# Altium project BoatCoreBoard.PrjPcb
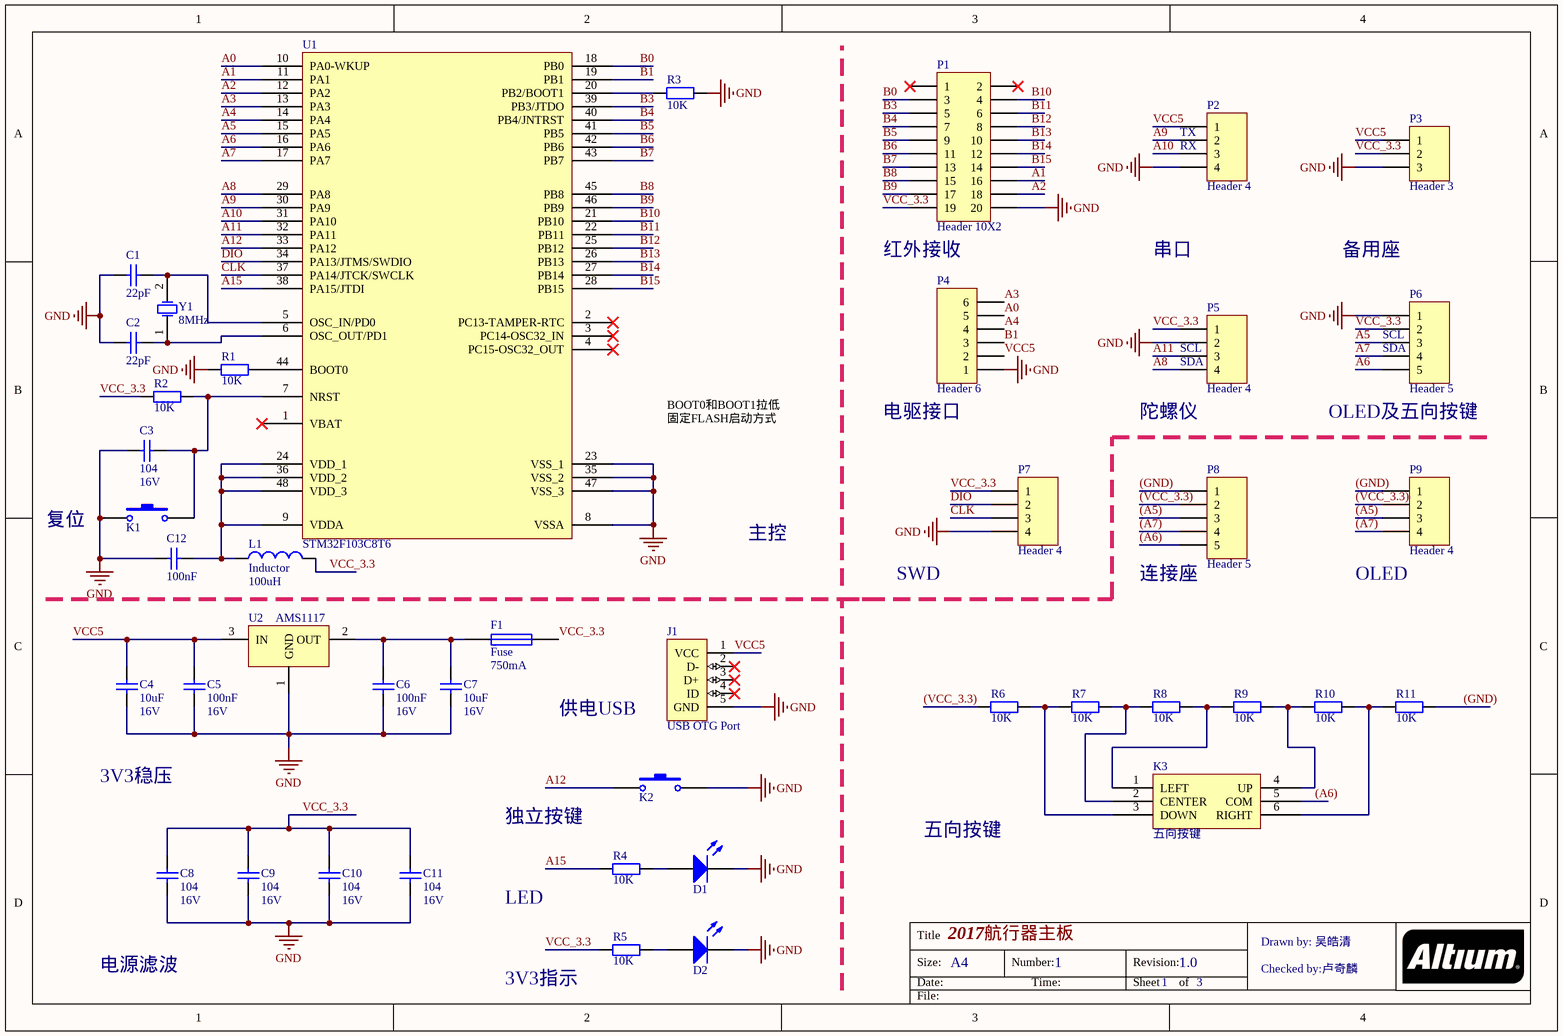
[diagram p0: core.SchDoc]
1 sheet, 43 parts. Net scope: global (net labels, ports and power ports of the same name join across sheets).
Board file: core.PcbDoc

## Sheet core.SchDoc: 2017航行器主板
size A4; Date: 2017/5/15; CheckedBy: 卢奇麟; Author: 吴皓清; DrawnBy: 吴皓清; DocumentNumber: 1; Revision: 1.0; SheetNumber: 1; SheetTotal: 3

### Parts
C1  value 22pF  [0805]  (hidden comment: Cap)
C2  value 22pF  [0805]  (hidden comment: Cap)
C3  value 104  Pressure Voltage: 16V  [0805]  (hidden comment: Cap)
C4  value 10uF  Pressure Voltage: 16V  [0805]  (hidden comment: Cap)
C5  value 100nF  Pressure Voltage: 16V  [0805]  (hidden comment: Cap)
C6  value 100nF  Pressure Voltage: 16V  [0805]  (hidden comment: Cap)
C7  value 10uF  Pressure Voltage: 16V  [0805]  (hidden comment: Cap)
C8  value 104  Pressure Voltage: 16V  [0805]  (hidden comment: Cap)
C9  value 104  Pressure Voltage: 16V  [0805]  (hidden comment: Cap)
C10  value 104  Pressure Voltage: 16V  [0805]  (hidden comment: Cap)
C11  value 104  Pressure Voltage: 16V  [0805]  (hidden comment: Cap)
C12  value 100nF  [0805]  (hidden comment: Cap)
D1  LED  [LED_0805]  (value not drawn)
D2  LED  [LED_0805]  (value not drawn)
F1  Fuse  I hold: 750mA  [0805]
J1  USB OTG Port  [Micro USB母座贴片]
K1  Key  [贴片按键3*6mm]  (value not drawn)
K2  Key  [贴片按键3*6mm]  (value not drawn)
K3  五向按键  [五向按键]
L1  Inductor  value 100uH  [0805]
P1  Header 10X2  [HDR2X10]
P2  Header 4  [HDR1X4]
P3  Header 3  [HDR1X3]
P4  Header 6  [HDR1X6]
P5  Header 4  [HDR1X4]
P6  Header 5  [HDR1X5]
P7  Header 4  [HDR1X4]
P8  Header 5  [HDR1X5]
P9  Header 4  [HDR1X4]
R1  value 10K  [0805]  (hidden comment: Res)
R2  value 10K  [0805]  (hidden comment: Res)
R3  value 10K  [0805]  (hidden comment: Res)
R4  value 10K  [0805]  (hidden comment: Res)
R5  value 10K  [0805]  (hidden comment: Res)
R6  value 10K  [0805]  (hidden comment: Res)
R7  value 10K  [0805]  (hidden comment: Res)
R8  value 10K  [0805]  (hidden comment: Res)
R9  value 10K  [0805]  (hidden comment: Res)
R10  value 10K  [0805]  (hidden comment: Res)
R11  value 10K  [0805]  (hidden comment: Res)
U1  STM32F103C8T6  [STM32F103C8T6]
U2  AMS1117  [AMS1117]
Y1  value 8MHz  [晶振49S型]  (hidden comment: 晶振)

### Nets
GND: C1.1 C2.1 C3.1 C4.1 C5.1 C6.1 C7.1 C8.1 C9.1 C10.1 C11.1 C12.1 D1.2(K) D2.2(K) J1.5(GND) K1.1 K2.2 P1.20 P2.4 P3.3 P4.1 P5.2 P6.1 P7.4 R1.1 R3.2 U1.8(VSSA) U1.23(VSS_1) U1.35(VSS_2) U1.47(VSS_3) U2.1(GND)
(A5): P8.3 P9.3
(A6): K3.5(COM) P8.5
(A7): P8.4 P9.4
(GND): P8.1 P9.1 R11.2
(VCC_3.3): P8.2 P9.2 R6.1
A0: P4.5 U1.10(PA0-WKUP)
A1: P1.16 U1.11(PA1)
A2: P1.18 U1.12(PA2)
A3: P4.6 U1.13(PA3)
A4: P4.4 U1.14(PA4)
A5: P6.3 U1.15(PA5)
A6: P6.5 U1.16(PA6)
A7: P6.4 U1.17(PA7)
A8: P5.4 U1.29(PA8)
A9: P2.2 U1.30(PA9)
A10: P2.3 U1.31(PA10)
A11: P5.3 U1.32(PA11)
A12: K2.1 U1.33(PA12)
A15: R4.1 U1.38(PA15/JTDI)
B0: P1.3 U1.18(PB0)
B1: P4.3 U1.19(PB1)
B3: P1.5 U1.39(PB3/JTDO)
B4: P1.7 U1.40(PB4/JNTRST)
B5: P1.9 U1.41(PB5)
B6: P1.11 U1.42(PB6)
B7: P1.13 U1.43(PB7)
B8: P1.15 U1.45(PB8)
B9: P1.17 U1.46(PB9)
B10: P1.4 U1.21(PB10)
B11: P1.6 U1.22(PB11)
B12: P1.8 U1.25(PB12)
B13: P1.10 U1.26(PB13)
B14: P1.12 U1.27(PB14)
B15: P1.14 U1.28(PB15)
CLK: P7.3 U1.37(PA14/JTCK/SWCLK)
DIO: P7.2 U1.34(PA13/JTMS/SWDIO)
VCC5: C4.2 C5.2 J1.1(VCC) P2.1 P3.1 P4.2 U2.3(IN)
VCC_3.3: C8.2 C9.2 C10.2 C11.2 F1.2 L1.2 P1.19 P3.2 P5.1 P6.2 P7.1 R2.1 R5.1
NetC1_2: C1.2 U1.5(OSC_IN/PD0) Y1.2(OSC2)
NetC2_2: C2.2 U1.6(OSC_OUT/PD1) Y1.1(OSC1)
NetC3_2: C3.2 K1.2 R2.2 U1.7(NRST)
NetC6_2: C6.2 C7.2 F1.1 U2.2(OUT)
NetC12_2: C12.2 L1.1 U1.9(VDDA) U1.24(VDD_1) U1.36(VDD_2) U1.48(VDD_3)
NetD1_1: D1.1(A) R4.2
NetD2_1: D2.1(A) R5.2
NetK3_1: K3.1(LEFT) R8.2 R9.1
NetK3_2: K3.2(CENTER) R7.2 R8.1
NetK3_3: K3.3(DOWN) R6.2 R7.1
NetK3_4: K3.4(UP) R9.2 R10.1
NetK3_6: K3.6(RIGHT) R10.2 R11.1
NetR1_2: R1.2 U1.44(BOOT0)
NetR3_1: R3.1 U1.20(PB2/BOOT1)

Not connected (* = marked no-connect by the designer): J1 2(D-)* 3(D+)* 4(ID)*; P1 1* 2*; U1 1(VBAT)* 2(PC13-TAMPER-RTC)* 3(PC14-OSC32_IN)* 4(PC15-OSC32_OUT)*

### Notes on the sheet
- (near P2) TX
- (near P2) RX
- (near P1) 红外接收
- 串口
- 备用座
- (near P5) SCL
- (near P5) SDA
- (near P6) SCL
- (near P6) SDA
- BOOT0和BOOT1拉低固定FLASH启动方式
- 电驱接口
- 陀螺仪
- (near P6) OLED及五向按键
- 复位
- 主控
- SWD
- (near P8) 连接座
- (near P9) OLED
- 供电USB
- 3V3稳压
- 独立按键
- 五向按键
- LED
- 电源滤波
- 3V3指示
- Drawn by: 吴皓清
- Checked by:卢奇麟
- Title
- Size:
- Date:
- A4
- Number:
- Time:
- Revision:
- Sheet
- of
- File:

### Library data of the parts
C1 C2 C12 = Cap: 原理图绘制者: 刘永钦; 原理图何处使用过: 2014年飞思卡尔底板; 原理图审核人1: 徐鹏飞; 封装0805何处使用: 2015年航行器遥控器; 原理图审核人2: 朱觉文; 封装0603何处使用过: 在2401转接板上使用; Pressure Voltage: 16V; 原理图提供者: 刘永钦; 封装0805绘制者: 刘永钦; 封装0805提供者: 刘永钦; 封装0805审核人1: 徐鹏飞; 封装0805审核人2: 朱觉文; 封装0603绘制者: 刘永钦; 封装0603提供者: 刘永钦; 封装0603审核人1: 朱觉文; 封装0603审核人2: 徐鹏飞
C3-C11 = Cap: 原理图绘制者: 刘永钦; 原理图何处使用过: 2014年飞思卡尔底板; 原理图审核人1: 徐鹏飞; 封装0805何处使用: 2015年航行器遥控器; 原理图审核人2: 朱觉文; 封装0603何处使用过: 在2401转接板上使用; 原理图提供者: 刘永钦; 封装0805绘制者: 刘永钦; 封装0805提供者: 刘永钦; 封装0805审核人1: 徐鹏飞; 封装0805审核人2: 朱觉文; 封装0603绘制者: 刘永钦; 封装0603提供者: 刘永钦; 封装0603审核人1: 朱觉文; 封装0603审核人2: 徐鹏飞
D1 D2 = LED: 原理图绘制者: 刘永钦; 原理图何处使用过: 2014年飞思卡尔底板; 原理图审核人1: 徐鹏飞; Color: 蓝色; 封装1210LED何处使用过: 2014年的一个小板子; 封装LED_3mm何处使用过: 2014年变频器面板; 封装LED_0805使用过: 2015年飞思卡尔底板; 原理图审核人2: 朱觉文; 封装LED0603何处使用过: 2401转接板; 原理图提供者: 刘永钦; 封装1210LED绘制者: 刘永钦; 封装1210LED提供者: 刘永钦; 封装1210LED审核人1: 徐鹏飞; 封装LED_3mm绘制者: 刘永钦; 封装LED_3mm提供者: 刘永钦; 封装LED_0805绘制者: 刘永钦; 封装LED_0805提供者: 刘永钦; 封装LED_0805审核人1: 徐鹏飞; 封装1210LED审核人2: 朱觉文; 封装LED_0805审核人2: 朱觉文; 封装LED_3mm审核者2: 朱觉文; 封装LED0603绘制者: 刘永钦; 封装LED0603审核人2: 朱觉文; 封装LED0603提供者: 刘永钦; 封装LED0603审核人1: 徐鹏飞
F1 = Fuse: 封装1812审核人2: 朱觉文; 封装1812审核人1: 徐鹏飞; 封装1812提供者: 刘永钦; 封装1812何处使用过: 2401转接板; 封装1812绘制者: 刘永钦; 原理图审核人2: 朱觉文; 原理图审核人1: 徐鹏飞; 原理图何处使用过: 2401转接板; 原理图提供者: 刘永钦; 原理图绘制者: 刘永钦
J1 = USB OTG Port: 原理图绘制者: 刘永钦; 原理图何处使用过: 2014年飞思卡尔底板; 原理图审核人1: 徐鹏飞; 封装Micro USB母座贴片使用过: 2014年一个小板子; 原理图审核人2: 朱觉文; 原理图提供者: 刘永钦; 封装Micro USB母座贴片绘制者: 刘永钦; 封装Micro USB母座贴片提供者: 刘永钦; 封装Micro USB母座贴片审核人1: 徐鹏飞; 封装Micro USB母座贴片审核人2: 朱觉文
K1 K2 = Key: 原理图绘制者: 刘永钦; 原理图何处使用过: 2014年飞思卡尔底板; 原理图审核人1: 徐鹏飞; 封装贴片按键3*6mm何处使用过: 2015年飞思卡尔底板; 封装四脚按键6*6mm使用过: 2014年变频器面板; 原理图审核人2: 朱觉文; 原理图提供者: 刘永钦; 封装贴片按键3*6mm绘制者: 刘永钦; 封装贴片按键3*6mm提供者: 刘永钦; 封装贴片按键3*6mm审核人1: 徐鹏飞; 封装四脚按键6*6mm绘制者: 刘永钦; 封装四脚按键6*6mm提供者: 刘永钦; 封装四脚按键6*6mm审核人1: 徐鹏飞; 封装四脚按键6*6mm审核人2: 朱觉文; 封装贴片按键3*6mm审核人2: 朱觉文
L1 = Inductor: 原理图绘制者: 刘永钦; 原理图何处使用过: 2014年飞思卡尔底板; 原理图审核人1: 徐鹏飞; 封装0805_Inductor绘制者: 未知; 封装0805_Inductor使用过: 2015年飞思卡尔底板; 原理图审核人2: 朱觉文; 原理图提供者: 刘永钦; 封装0805_Inductor提供者: 刘永钦; 封装0805_Inductor审核人1: 徐鹏飞; 封装0805_Inductor审核人2: 朱觉文
P1 = Header 10X2: Header, 10-Pin, Dual row; LatestRevisionDate: 17-Jul-2002; LatestRevisionNote: Re-released for DXP Platform.; Publisher: Altium Limited
P2 P5 P7 P9 = Header 4: Header, 4-Pin; LatestRevisionDate: 17-Jul-2002; LatestRevisionNote: Re-released for DXP Platform.; Publisher: Altium Limited
P3 = Header 3: Header, 3-Pin; LatestRevisionDate: 17-Jul-2002; LatestRevisionNote: Re-released for DXP Platform.; Publisher: Altium Limited
P4 = Header 6: Header, 6-Pin; LatestRevisionDate: 17-Jul-2002; LatestRevisionNote: Re-released for DXP Platform.; Publisher: Altium Limited
P6 P8 = Header 5: Header, 5-Pin; LatestRevisionDate: 17-Jul-2002; LatestRevisionNote: Re-released for DXP Platform.; Publisher: Altium Limited
R1-R11 = Res: 原理图绘制者: 刘永钦; 原理图何处使用过: 2014年飞思卡尔底板; 原理图审核人1: 徐鹏飞; 封装0805何处使用过: 2015年航行器遥控器; 原理图审核人2: 朱觉文; 封装2512-RESC6332X06N何处使用过: 在无刷直流电机驱动板上使用过; 封装0603何处使用过: 在2401转接板上使用; 原理图提供者: 刘永钦; 封装0805绘制者: 刘永钦; 封装0805提供者: 刘永钦; 封装0805审核人1: 徐鹏飞; 封装0805审核人2: 朱觉文; 封装0603提供者: 刘永钦; 封装0603审核人2: 朱觉文; 封装0603审核人1: 徐鹏飞; 封装2512-RESC6332X06N审核人2: 朱觉文; 封装2512-RESC6332X06N提供者: 刘永钦; 封装2512-RESC6332X06N审核人1: 徐鹏飞; 封装0603绘制者: 刘永钦; 封装2512-RESC6332X06N绘制者: 刘永钦
U2 = AMS1117: 原理图绘制者: 刘永钦; 原理图何处使用过: 2014年飞思卡尔底板; 原理图审核人1: 徐鹏飞; 原理图审核人2: 朱觉文; 原理图提供者: 刘永钦; 封装AMS1117绘制者: 刘永钦; 封装AMS1117提供者: 刘永钦; 封装AMS1117何处使用: 2014年飞思卡尔底板; 封装AMS1117审核人1: 徐鹏飞; 封装AMS1117审核人2: 朱觉文
Y1 = 晶振: 原理图绘制者: 刘永钦; 原理图何处使用过: 2014年飞思卡尔底板; 原理图审核人1: 徐鹏飞; 封装晶振49S型使用过: 2014年变频器面板; 原理图审核人2: 朱觉文; 封装晶振49SMD何处使用过: 2401转接板; 原理图提供者: 刘永钦; 封装晶振49S型绘制者: 刘永钦; 封装晶振49S型审核人1: 徐鹏飞; 封装晶振49S型提供者: 刘永钦; 封装晶振49S型审核人2: 朱觉文; 封装晶振49SMD绘制者: 刘永钦; 封装晶振49SMD提供者: 刘永钦; 封装晶振49SMD审核人2: 朱觉文; 封装晶振49SMD审核人1: 徐鹏飞